# Altium schematic sheet L293D.SchDoc
size A4
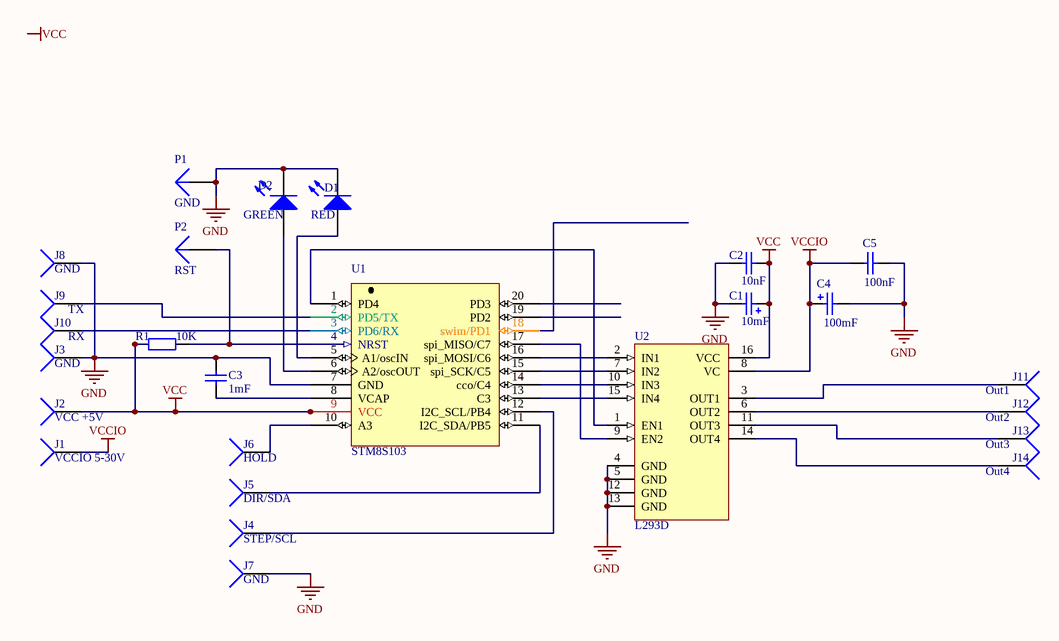
[diagram p0: L293D.SchDoc]

## Parts
C1  value 10mF  [POLAR0.8]
C2  value 10nF  [RAD-0.3]  (hidden comment: Cap)
C3  value 1mF  [RAD-0.3]  (hidden comment: Cap)
C4  value 100mF  [POLAR0.8]
C5  value 100nF  [RAD-0.3]  (hidden comment: Cap)
D1  RED  [3.5X2.8X1.9]
D2  GREEN  [3.5X2.8X1.9]
J1  VCCIO 5-30V  [PIN1]
J2  VCC +5V  [PIN1]
J3  GND  [PIN1]
J4  STEP/SCL  [PIN1]
J5  DIR/SDA  [PIN1]
J6  HOLD  [PIN1]
J7  GND  [PIN1]
J8  GND  [PIN1]
J9  TX  [PIN1]
J10  RX  [PIN1]
J11  Out1  [PIN1]
J12  Out2  [PIN1]
J13  Out3  [PIN1]
J14  Out4  [PIN1]
P1  GND  [PIN1]
P2  RST  [PIN1]
R1  value 10K  [AXIAL-0.4]  (hidden comment: Res2)
U1  STM8S103
U2  L293D  [DIP16]

## Nets
GND: C1.2 C2.2 C3.1 C4.2 C5.2 D1.2(K) D2.2(K) J3.1 J7.1 J8.1 P1.1 U1.7(GND) U2.4(GND) U2.5(GND) U2.12(GND) U2.13(GND)
VCC: C1.1 C2.1 J2.1 R1.2 U1.9(VCC) U2.16(VCC)
VCCIO: C4.1 C5.1 J1.1 U2.8(VC)
NetC3_2: C3.2 U1.8(VCAP)
NetD1_1: D1.1(A) U1.5(A1/oscIN)
NetD2_1: D2.1(A) U1.6(A2/oscOUT)
NetJ4_1: J4.1 U1.12(I2C_SCL/PB4)
NetJ5_1: J5.1 U1.11(I2C_SDA/PB5)
NetJ6_1: J6.1 U1.10(A3)
NetJ9_1: J9.1 U1.2(PD5/TX)
NetJ10_1: J10.1 U1.3(PD6/RX)
NetJ11_1: J11.1 U2.3(OUT1)
NetJ12_1: J12.1 U2.6(OUT2)
NetJ13_1: J13.1 U2.11(OUT3)
NetJ14_1: J14.1 U2.14(OUT4)
NetP2_1: P2.1 R1.1 U1.4(NRST)
NetU1_1: U1.1(PD4) U2.1(EN1)
NetU1_13: U1.13(C3) U2.15(IN4)
NetU1_14: U1.14(cco/C4) U2.10(IN3)
NetU1_15: U1.15(spi_SCK/C5) U2.7(IN2)
NetU1_16: U1.16(spi_MOSI/C6) U2.2(IN1)
NetU1_17: U1.17(spi_MISO/C7) U2.9(EN2)

Not connected (* = marked no-connect by the designer): U1 18(swim/PD1) 19(PD2) 20(PD3)

## Notes on the sheet
- Labels drawn without touching a wire or pin: VCC

## Library data of the parts
C1 C4 = Cap Pol2: Polarized Capacitor (Axial); Published: 8-Jun-2000; LatestRevisionDate: 17-Jul-2002; LatestRevisionNote: Re-released for DXP Platform.; PackageReference: POLAR0.8; Publisher: Altium Limited; PackageDescription: Polarized Capacitor; 2 Leads
C2 C3 C5 = Cap: Capacitor; Published: 8-Jun-2000; LatestRevisionDate: 17-Jul-2002; LatestRevisionNote: Re-released for DXP Platform.; PackageReference: RAD-0.3; Publisher: Altium Limited; PackageDescription: Radial Cap, Thru-Hole; 2 Leads; 0.3 in Pin Spacing
D1 D2 = LED3: Typical BLUE SiC LED; Published: 8-Jun-2000; LatestRevisionDate: 17-Dec-2003; LatestRevisionNote: PCB Footprint replaced.; DatasheetVersion: 16-Apr-2002; PackageVersion: 16-Apr-2002; PackageReference: 3.5X2.8X1.9; Publisher: Altium Limited; PackageDescription: SM LED; 2 C-Bend Leads; Body 3.5 x 2.8 x 1.9 mm, inc leads (LxWxH typ)
J1-J14 = Socket: LatestRevisionDate: 17-Jul-2002; LatestRevisionNote: Re-released for DXP Platform.; Publisher: Altium Limited
P1 P2 = Plug: LatestRevisionDate: 17-Jul-2002; LatestRevisionNote: Re-released for DXP Platform.; Publisher: Altium Limited
R1 = Res2: Resistor; Published: 8-Jun-2000; LatestRevisionDate: 17-Jul-2002; LatestRevisionNote: Re-released for DXP Platform.; PackageReference: AXIAL-0.4; Publisher: Altium Limited; PackageDescription: Axial Device, Thru-Hole; 2 Leads; 0.4 in Pin Spacing
U2 = L293D: Push-Pull Four Channel Driver With Diode; Published: 8-Jun-2000; LatestRevisionDate: 06-Jun-2005; LatestRevisionNote: Stylized 3D Model Added.; DatasheetVersion: Jun-1996; PackageVersion: Apr-1996; PackageReference: DIP16; Publisher: Altium Limited; PackageDescription: DIP; 16 Leads; Row Spacing 7.62 mm; Pitch 2.54 mm; ComponentLink1Description: Manufacturer Link; ComponentLink1URL: http://www.st.com/; ComponentLink2Description: Datasheet; ComponentLink2URL: http://www.st.com/stonline/products/literature/ds/1330/l293d.pdf